# Altium project Power_manage.PrjPcb
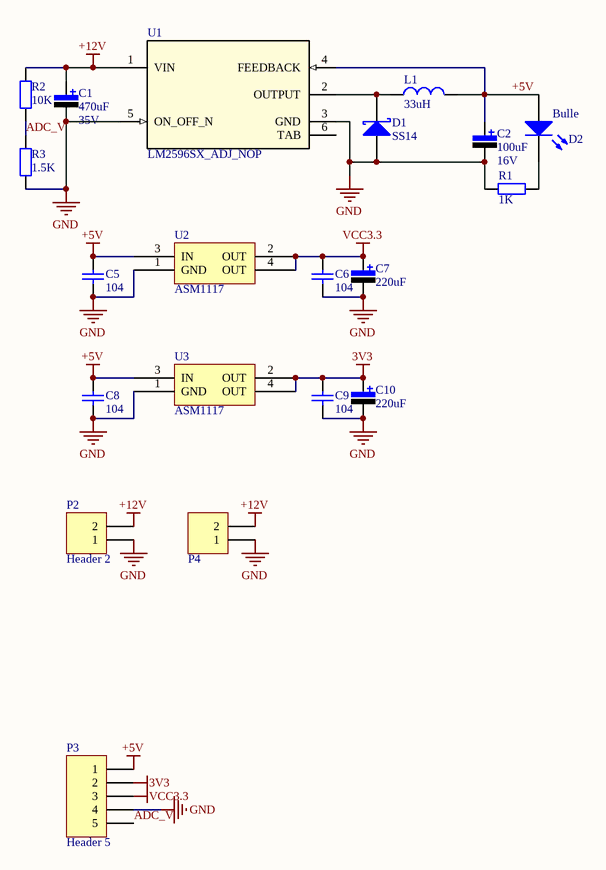
[diagram p0: power_manage.SchDoc]
1 sheet, 20 parts. Net scope: global (net labels, ports and power ports of the same name join across sheets).
Board files: power_manage.PcbDoc, power.PcbDoc, POWER_ADM.PcbDoc

## Sheet power_manage.SchDoc
size A4

### Parts
C1  value 470uF  Vol: 35V  [C-RB-S10]  (hidden comment: Cap Pol)
C2  value 100uF  Vol: 16V  [C-RB-S10]  (hidden comment: Cap Pol)
C5  value 104  [C-RAD-0603]  (hidden comment: Cap)
C6  value 104  [C-RAD-0603]  (hidden comment: Cap)
C7  value 220uF  [C-RB-S8]  (hidden comment: Cap Pol)
C8  value 104  [C-RAD-0603]  (hidden comment: Cap)
C9  value 104  [C-RAD-0603]  (hidden comment: Cap)
C10  value 220uF  [C-RB-S8]  (hidden comment: Cap Pol)
D1  Type: SS14  [DIODE-SMC]  (hidden comment: D-Schottky)
D2  Bulle  [LED_0805]
L1  value 33uH  [L-SMD-7]  (hidden comment: Inductor)
P2  Header 2  [HDR2X1_B2]
P3  Header 5  [HDR1X5]
P4  Header 2  [KF301_2]  (value not drawn)
R1  value 1K  [0805-1]  (hidden comment: Res1)
R2  value 10K  [0805-1]  (hidden comment: Res1)
R3  value 1.5K  [0805-1]  (hidden comment: Res1)
U1  LM2596SX_ADJ_NOP  [TO-263-5]
U2  ASM1117  [SOT-223]
U3  ASM1117  [SOT-223]

### Nets
3V3: C9.2 C10.1 P3.2 U3.2(OUT) U3.4(OUT)
+5V: C2.1 C5.2 C8.2 D2.1(A) L1.2 P3.1 U1.4(FEEDBACK) U2.3(IN) U3.3(IN)
+12V: C1.1 P2.2 P4.2 R2.2 U1.1(VIN)
GND: C1.2 C2.2 C5.1 C6.1 C7.2 C8.1 C9.1 C10.2 D1.1(A) P2.1 P3.4 P4.1 R1.1 R3.1 U1.3(GND) U1.5(ON_OFF_N) U2.1(GND) U3.1(GND)
VCC3.3: C6.2 C7.1 P3.3 U2.2(OUT) U2.4(OUT)
ADC_V: P3.5 R2.1 R3.2
NetD1_2: D1.2(K) L1.1 U1.2(OUTPUT)
NetD2_2: D2.2(K) R1.2

Not connected (* = marked no-connect by the designer): U1 6(TAB)

### Library data of the parts
C1 C2 = Cap Pol: 极性电解电容; Published: 8-Jun-2000; LatestRevisionDate: 17-Jul-2002; LatestRevisionNote: Re-released for DXP Platform.; PackageReference: RB7.6-15; Publisher: Altium Limited
C5 C6 C8 C9 = Cap: 无极性电容; Published: 8-Jun-2000; LatestRevisionDate: 17-Jul-2002; LatestRevisionNote: Re-released for DXP Platform.; PackageReference: RAD-0.3; Publisher: Altium Limited
C7 C10 = Cap Pol: 极性电解电容; Vol: 16V; Published: 8-Jun-2000; LatestRevisionDate: 17-Jul-2002; LatestRevisionNote: Re-released for DXP Platform.; PackageReference: RB7.6-15; Publisher: Altium Limited
D1 = D-Schottky: 肖特基二极管; Published: 8-Jun-2000; LatestRevisionDate: 17-Jul-2002; LatestRevisionNote: Re-released for DXP Platform.; PackageReference: SMB; Publisher: Altium Limited; Code_JEDEC: DO-214-AA
D2 = LED0: 发光二极管; Published: 8-Jun-2000; LatestRevisionDate: 08-Jul-2005; LatestRevisionNote: Mech Layer 1 removed.; PackageReference: LED-0; Publisher: Altium Limited
L1 = Inductor: 电感; Code_IEC: 1005; Published: 8-Jun-2000; LatestRevisionDate: 17-Jul-2002; LatestRevisionNote: Re-released for DXP Platform.; PackageReference: 0402-A; Publisher: Altium Limited; Code_JEITA: 0402
P2 = Header 2: Header, 2-Pin; LatestRevisionDate: 17-Jul-2002; LatestRevisionNote: Re-released for DXP Platform.; Publisher: Altium Limited
P3 = Header 5: Header, 5-Pin; LatestRevisionDate: 17-Jul-2002; LatestRevisionNote: Re-released for DXP Platform.; Publisher: Altium Limited
P4 = Header 2: 接插件; LatestRevisionDate: 17-Jul-2002; LatestRevisionNote: Re-released for DXP Platform.; Publisher: Altium Limited
R1-R3 = Res1: 贴片电阻; Published: 8-Jun-2000; LatestRevisionDate: 17-Jul-2002; LatestRevisionNote: Re-released for DXP Platform.; PackageReference: AXIAL-0.4; Publisher: Altium Limited
U1 = LM2596SX_ADJ_NOP: Imported; PartNumber: LM2596SX-ADJ/NOPB; Alternate_PartNumber: LM2596S-ADJ/NOPB; Manufacturer: Texas Instruments; CompType: IC; PIN_COUNT: 6; PackageReference: KTT0005B; MountType: SMT; RoHS: Y; RefDes: RefDes; TYPE: TYPE; Value: Value
U2 U3 = ASM1117: 3.3V稳压芯片